# Altium schematic sheet PMU.SchDoc
size A4
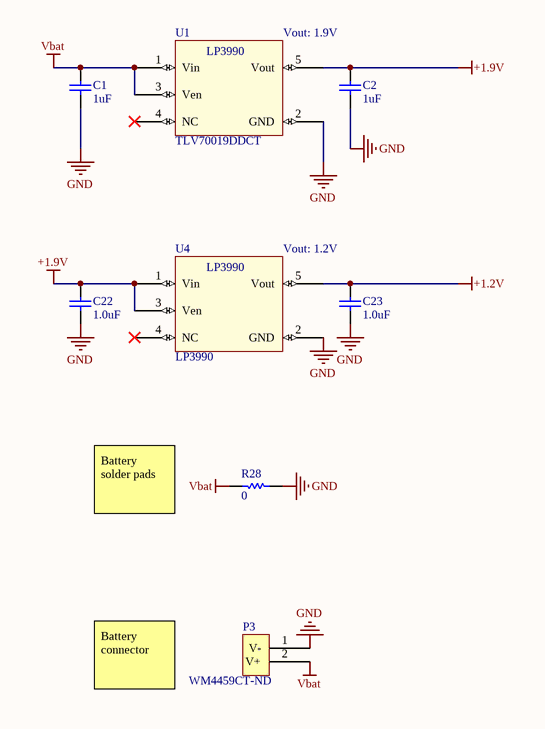
[diagram p0: PMU.SchDoc]

## Parts
C1  value 1uF  [0402]
C2  value 1uF  [0402]
C22  value 1.0uF  [0201_Custom]
C23  value 1.0uF  [0201_Custom]
P3  WM4459CT-ND  [WM4459CT-ND_Footprint]
R28  value 0  [1608[0603]]
U1  TLV70019DDCT  Vout: 1.9V  [SOT23-5Metric]
U4  LP3990  Vout: 1.2V  [SOT23-5Metric]

## Nets
+1.2V: C23.1 U4.5(Vout)
+1.9V: C2.2 C22.1 U1.5(Vout) U4.1(Vin) U4.3(Ven)
GND: C1.1 C2.1 C22.2 C23.2 P3.1(V-) R28.1 U1.2(GND) U4.2(GND)
Vbat: C1.2 P3.2(V+) R28.2 U1.1(Vin) U1.3(Ven)

Not connected (* = marked no-connect by the designer): U1 4(NC)*; U4 4(NC)*

## Notes on the sheet
- Battery solder pads
- Battery connector

## Library data of the parts
C1 C2 C22 C23 = Cap Semi: Capacitor (Semiconductor SIM Model); Published: 8-Jun-2000; LatestRevisionDate: 29-May-2009; LatestRevisionNote: IPC-7351 Footprint Added.; PackageReference: C1206; Publisher: Altium Limited; PackageDescription: Chip Capacitor
P3 = WM4459CT-ND: 1.20MM WTB RECEPT CONNECTOR
R28 = Res Semi: Semiconductor Resistor; Published: 8-Jun-2000; LatestRevisionDate: 17-Jul-2002; LatestRevisionNote: Re-released for DXP Platform.; PackageReference: AXIAL-0.5; Publisher: Altium Limited; PackageDescription: Axial Device, Thru-Hole; 2 Leads; 0.5 in Pin Spacing
U1 U4 = LP3990: 150mA Linear Voltage Regulator for Digital Applications; Package: SOT-23